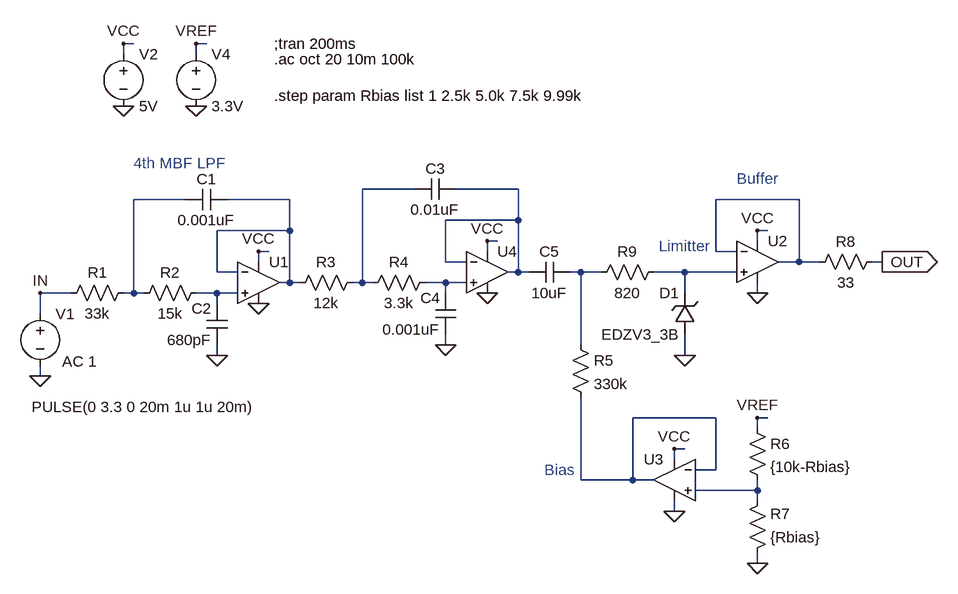
[diagram p0: schematic ArduinoLFO_Ouput_Board_Zener_Limiter_MFB_Bias.asc]
ArduinoLFO_Ouput_Board_Zener_Limiter_MFB_Bias.asc, the LTspice schematic file:
Version 4
SHEET 1 1700 680
WIRE 208 -272 192 -272
WIRE 320 -272 304 -272
WIRE 192 -256 192 -272
WIRE 304 -256 304 -272
WIRE 640 -48 560 -48
WIRE 800 -48 704 -48
WIRE 288 -32 208 -32
WIRE 448 -32 352 -32
WIRE 1232 -32 1104 -32
WIRE 800 0 800 -48
WIRE 800 0 688 0
WIRE 448 16 448 -32
WIRE 448 16 336 16
WIRE 1184 16 1168 16
WIRE 768 32 752 32
WIRE 1168 32 1168 16
WIRE 416 48 400 48
WIRE 752 48 752 32
WIRE 1104 48 1104 -32
WIRE 1136 48 1104 48
WIRE 400 64 400 48
WIRE 688 64 688 0
WIRE 720 64 688 64
WIRE 1232 64 1232 -32
WIRE 1232 64 1200 64
WIRE 1264 64 1232 64
WIRE 1360 64 1344 64
WIRE 336 80 336 16
WIRE 368 80 336 80
WIRE 800 80 800 0
WIRE 800 80 784 80
WIRE 816 80 800 80
WIRE 896 80 880 80
WIRE 928 80 896 80
WIRE 1056 80 1008 80
WIRE 1136 80 1056 80
WIRE 448 96 448 16
WIRE 448 96 432 96
WIRE 464 96 448 96
WIRE 560 96 560 -48
WIRE 560 96 544 96
WIRE 576 96 560 96
WIRE 688 96 656 96
WIRE 720 96 688 96
WIRE 112 112 64 112
WIRE 208 112 208 -32
WIRE 208 112 192 112
WIRE 224 112 208 112
WIRE 336 112 304 112
WIRE 368 112 336 112
WIRE 688 112 688 96
WIRE 1056 112 1056 80
WIRE 1168 112 1168 96
WIRE 336 128 336 112
WIRE 64 144 64 112
WIRE 688 192 688 176
WIRE 896 192 896 80
WIRE 336 208 336 192
WIRE 1056 208 1056 176
WIRE 64 240 64 224
WIRE 1104 304 976 304
WIRE 1184 304 1168 304
WIRE 1168 320 1168 304
WIRE 1056 352 1040 352
WIRE 1040 368 1040 352
WIRE 1104 384 1104 304
WIRE 1104 384 1072 384
WIRE 896 400 896 272
WIRE 976 400 976 304
WIRE 976 400 896 400
WIRE 1008 400 976 400
WIRE 1168 416 1168 400
WIRE 1168 416 1072 416
WIRE 1168 432 1168 416
WIRE 1040 448 1040 432
WIRE 1168 528 1168 512
FLAG 64 240 0
FLAG 64 112 IN
FLAG 1360 64 OUT
IOPIN 1360 64 Out
FLAG 192 -176 0
FLAG 192 -272 VCC
FLAG 1168 16 VCC
FLAG 1168 112 0
FLAG 304 -176 0
FLAG 304 -272 VREF
FLAG 1040 352 VCC
FLAG 1040 448 0
FLAG 1168 528 0
FLAG 1168 304 VREF
FLAG 1056 208 0
FLAG 752 112 0
FLAG 400 128 0
FLAG 752 32 VCC
FLAG 400 48 VCC
FLAG 688 192 0
FLAG 336 208 0
SYMBOL voltage 64 128 R0
WINDOW 3 -13 159 Left 2
WINDOW 123 34 89 Left 2
WINDOW 39 0 0 Left 2
SYMATTR Value PULSE(0 3.3 0 20m 1u 1u 20m)
SYMATTR Value2 AC 1
SYMATTR InstName V1
SYMBOL voltage 192 -272 R0
SYMATTR InstName V2
SYMATTR Value 5V
SYMBOL res 880 176 R0
SYMATTR InstName R5
SYMATTR Value 330k
SYMBOL cap 880 64 R90
WINDOW 0 0 32 VBottom 2
WINDOW 3 32 32 VTop 2
SYMATTR InstName C5
SYMATTR Value 10uF
SYMBOL Opamps\\UniversalOpamp2 1168 64 R0
SYMATTR InstName U2
SYMBOL voltage 304 -272 R0
SYMATTR InstName V4
SYMATTR Value 3.3V
SYMBOL Opamps\\UniversalOpamp2 1040 400 M0
SYMATTR InstName U3
SYMBOL res 1152 304 R0
SYMATTR InstName R6
SYMATTR Value {10k-Rbias}
SYMBOL res 1152 528 M180
WINDOW 0 36 76 Left 2
WINDOW 3 36 40 Left 2
SYMATTR InstName R7
SYMATTR Value {Rbias}
SYMBOL res 1360 48 R90
WINDOW 0 0 56 VBottom 2
WINDOW 3 32 56 VTop 2
SYMATTR InstName R8
SYMATTR Value 33
SYMBOL res 1024 64 R90
WINDOW 0 0 56 VBottom 2
WINDOW 3 32 56 VTop 2
SYMATTR InstName R9
SYMATTR Value 820
SYMBOL zener 1072 176 R180
WINDOW 0 24 64 Left 2
WINDOW 3 24 0 Left 2
SYMATTR InstName D1
SYMATTR Value EDZV3_3B
SYMBOL Opamps\\UniversalOpamp2 400 96 R0
SYMATTR InstName U1
SYMBOL Opamps\\UniversalOpamp2 752 80 R0
SYMATTR InstName U4
SYMBOL res 208 96 R90
WINDOW 0 0 56 VBottom 2
WINDOW 3 32 56 VTop 2
SYMATTR InstName R1
SYMATTR Value 33k
SYMBOL res 320 96 R90
WINDOW 0 0 56 VBottom 2
WINDOW 3 32 56 VTop 2
SYMATTR InstName R2
SYMATTR Value 15k
SYMBOL res 560 80 R90
WINDOW 0 0 56 VBottom 2
WINDOW 3 32 56 VTop 2
SYMATTR InstName R3
SYMATTR Value 12k
SYMBOL res 672 80 R90
WINDOW 0 0 56 VBottom 2
WINDOW 3 32 56 VTop 2
SYMATTR InstName R4
SYMATTR Value 3.3k
SYMBOL cap 352 -48 R90
WINDOW 0 0 32 VBottom 2
WINDOW 3 32 32 VTop 2
SYMATTR InstName C1
SYMATTR Value 0.001uF
SYMBOL cap 352 128 M0
SYMATTR InstName C2
SYMATTR Value 680pF
SYMBOL cap 704 -64 R90
WINDOW 0 0 32 VBottom 2
WINDOW 3 32 32 VTop 2
SYMATTR InstName C3
SYMATTR Value 0.01uF
SYMBOL cap 704 176 R180
WINDOW 0 24 56 Left 2
WINDOW 3 24 8 Left 2
SYMATTR InstName C4
SYMATTR Value 0.001uF
TEXT 424 -272 Left 2 !;tran 200ms
TEXT 424 -248 Left 2 !.ac oct 20 10m 100k
TEXT 424 -192 Left 2 !.step param Rbias list 1 2.5k 5.0k 7.5k 9.99k
TEXT 208 -88 Left 2 ;4th MBF LPF
TEXT 1016 40 Left 2 ;Limitter
TEXT 840 384 Left 2 ;Bias
TEXT 1136 -64 Left 2 ;Buffer

The netlist it stands for:
* ArduinoLFO_Ouput_Board_Zener_Limiter_MFB_Bias.asc
V1 IN 0 PULSE(0 3.3 0 20m 1u 1u 20m) AC 1
V2 VCC 0 5V
R5 N006 N010 330k
C5 N006 N002 10uF
XU2 N007 N005 VCC 0 N005 level.2 Avol=1Meg GBW=10Meg Slew=10Meg ilimit=25m rail=0 Vos=0 phimargin=45 en=0 enk=0 in=0 ink=0 Rin=500Meg  ; pins IN+ IN- V+ V- OUT
V4 VREF 0 3.3V
XU3 N011 N010 VCC 0 N010 level.2 Avol=1Meg GBW=10Meg Slew=10Meg ilimit=25m rail=0 Vos=0 phimargin=45 en=0 enk=0 in=0 ink=0 Rin=500Meg  ; pins IN+ IN- V+ V- OUT
R6 VREF N011 {10k-Rbias}
R7 0 N011 {Rbias}
R8 OUT N005 33
R9 N007 N006 820
D1 0 N007 EDZV3_3B
XU1 N009 N004 VCC 0 N004 level.2 Avol=1Meg GBW=10Meg Slew=10Meg ilimit=25m rail=0 Vos=0 phimargin=45 en=0 enk=0 in=0 ink=0 Rin=500Meg  ; pins IN+ IN- V+ V- OUT
XU4 N008 N002 VCC 0 N002 level.2 Avol=1Meg GBW=10Meg Slew=10Meg ilimit=25m rail=0 Vos=0 phimargin=45 en=0 enk=0 in=0 ink=0 Rin=500Meg  ; pins IN+ IN- V+ V- OUT
R1 N003 IN 33k
R2 N009 N003 15k
R3 N001 N004 12k
R4 N008 N001 3.3k
C1 N004 N003 0.001uF
C2 N009 0 680pF
C3 N002 N001 0.01uF
C4 0 N008 0.001uF
.model D D
.lib standard.dio
;tran 200ms
.ac oct 20 10m 100k
.step param Rbias list 1 2.5k 5.0k 7.5k 9.99k
* 4th MBF LPF
* Limitter
* Bias
* Buffer
.lib UniversalOpamps2.sub
.backanno
.end